# Altium schematic sheet battery cape.SchDoc
size A4
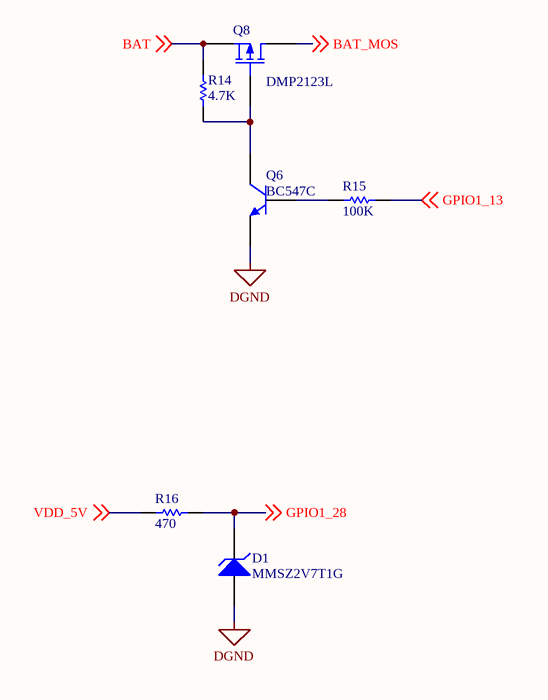
[diagram p0: battery cape.SchDoc]

## Parts
D1  MMSZ2V7T1G  [DIODE-0.7]
Q6  BC547C  [SOT-23B_N]
Q8  DMP2123L  [E3]
R14  4.7K  [AXIAL-0.3]
R15  100K  [AXIAL-0.3]
R16  470  [AXIAL-0.3]

## Nets
DGND: D1.1(A) Q6.3(E)
BAT: Q8.3(S) R14.2 ; off-sheet BAT
BAT_MOS: Q8.1(D) ; off-sheet BAT_MOS
GPIO1_13: R15.2 ; off-sheet GPIO1_13
GPIO1_28: D1.2(K) R16.2 ; off-sheet GPIO1_28
VDD_5V: R16.1 ; off-sheet VDD_5V
NetQ6_1: Q6.1(C) Q8.2(G) R14.1
NetQ6_2: Q6.2(B) R15.1

## Library data of the parts
D1 = D Zener: Zener Diode; Published: 8-Jun-2000; LatestRevisionDate: 17-Jul-2002; LatestRevisionNote: Re-released for DXP Platform.; PackageReference: DIODE-0.7; Publisher: Altium Limited; PackageDescription: Diode, Thru-Hole; 2 Leads; 0.7 in Pin Spacing
Q6 = QNPN: NPN Bipolar Transistor; Published: 8-Jun-2000; LatestRevisionDate: 29-May-2009; LatestRevisionNote: IPC-7351 Footprint Added.; PackageVersion: Aug-1999; PackageReference: SOT-23B; Publisher: Altium Limited; PackageDescription: 3-Pin SOT-23 Package 0.95 mm Pitch, 2.4 mm Lead Span
Q8 = MOSFET-P: P-Channel MOSFET; Published: 8-Jun-2000; LatestRevisionDate: 17-Jul-2002; LatestRevisionNote: Re-released for DXP Platform.; PackageVersion: 1995/1996; PackageReference: E3; Publisher: Altium Limited; PackageDescription: TO, Flat Index; 3 In-Line, Axial Leads; Body Dia. 4.6mm; Lead Dia. 0.5 mm (max)
R14 = Res1: Value: 1K; Published: 8-Jun-2000; LatestRevisionDate: 17-Jul-2002; LatestRevisionNote: Re-released for DXP Platform.; PackageReference: AXIAL-0.3; Publisher: Altium Limited; PackageDescription: Axial Device, Thru-Hole; 2 Leads; 0.3 in Pin Spacing
R15 R16 = Res1: Resistor; Value: 1K; Published: 8-Jun-2000; LatestRevisionDate: 17-Jul-2002; LatestRevisionNote: Re-released for DXP Platform.; PackageReference: AXIAL-0.3; Publisher: Altium Limited; PackageDescription: Axial Device, Thru-Hole; 2 Leads; 0.3 in Pin Spacing